# Altium schematic sheet ZLS-026.SchDoc
size Tabloid
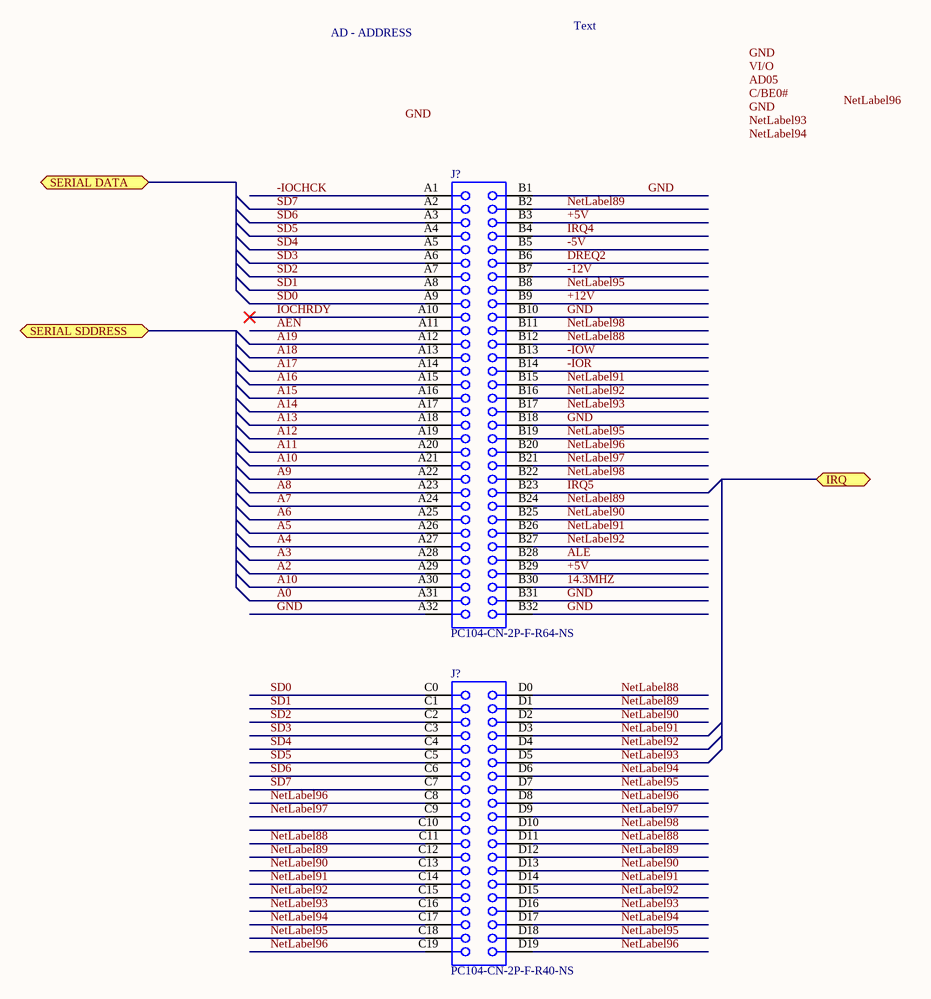
[diagram p0: ZLS-026.SchDoc]

## Parts
(Parts that share a designator on the sheet are numbered #1, #2 ... from top to bottom, then left to right.)
J?#1  PC104-CN-2P-F-R64-NS  [BTB2-54-V64F-03]
J?#2  PC104-CN-2P-F-R40-NS  [BTB2-54-V40F-03]

## Ports
IRQ, SERIAL DATA, SERIAL SDDRESS

## Nets
14.3MHZ: J?#1.B30
+5V: J?#1.B3 J?#1.B29
+12V: J?#1.B9
-5V: J?#1.B5
-12V: J?#1.B7
-IOCHCK: J?#1.A1
-IOR: J?#1.B14
-IOW: J?#1.B13
A0: J?#1.A31
A2: J?#1.A29
A3: J?#1.A28
A4: J?#1.A27
A5: J?#1.A26
A6: J?#1.A25
A7: J?#1.A24
A8: J?#1.A23
A9: J?#1.A22
A10: J?#1.A21 J?#1.A30
A11: J?#1.A20
A12: J?#1.A19
A13: J?#1.A18
A14: J?#1.A17
A15: J?#1.A16
A16: J?#1.A15
A17: J?#1.A14
A18: J?#1.A13
A19: J?#1.A12
AEN: J?#1.A11
ALE: J?#1.B28
DREQ2: J?#1.B6
GND: J?#1.A32 J?#1.B1 J?#1.B10 J?#1.B18 J?#1.B31 J?#1.B32
IOCHRDY: J?#1.A10
IRQ4: J?#1.B4
IRQ5: J?#1.B23
NetLabel88: J?#1.B12 J?#2.C11 J?#2.D0 J?#2.D11
NetLabel89: J?#1.B2 J?#1.B24 J?#2.C12 J?#2.D1 J?#2.D12
NetLabel90: J?#1.B25 J?#2.C13 J?#2.D2 J?#2.D13
NetLabel91: J?#1.B15 J?#1.B26 J?#2.C14 J?#2.D3 J?#2.D14
NetLabel92: J?#1.B16 J?#1.B27 J?#2.C15 J?#2.D4 J?#2.D15
NetLabel93: J?#1.B17 J?#2.C16 J?#2.D5 J?#2.D16
NetLabel94: J?#2.C17 J?#2.D6 J?#2.D17
NetLabel95: J?#1.B8 J?#1.B19 J?#2.C18 J?#2.D7 J?#2.D18
NetLabel96: J?#1.B20 J?#2.C8 J?#2.C19 J?#2.D8 J?#2.D19
NetLabel97: J?#1.B21 J?#2.C9 J?#2.D9
NetLabel98: J?#1.B11 J?#1.B22 J?#2.D10
SD0: J?#1.A9 J?#2.C0
SD1: J?#1.A8 J?#2.C1
SD2: J?#1.A7 J?#2.C2
SD3: J?#1.A6 J?#2.C3
SD4: J?#1.A5 J?#2.C4
SD5: J?#1.A4 J?#2.C5
SD6: J?#1.A3 J?#2.C6
SD7: J?#1.A2 J?#2.C7

Not connected (* = marked no-connect by the designer): J?#2 C10(31)

## Notes on the sheet
- AD - ADDRESS
- Text
- Labels drawn without touching a wire or pin: AD05, C/BE0#, GND, NetLabel93, NetLabel94, NetLabel96, VI/O
- Title
- Size:
- Date:
- Tabloid
- Number:
- Time:
- Revision:
- Sheet
- of
- ZLS Corporation
- 7801 North Lamar Blvd.
- Suite E-184
- Austin, Texas 78752  USA
- (512) 453-0288
- File:

## Library data of the parts
J?#1 = CMP-0001-00109-1: Board-to-Board Connector,  PC104 BA ISA, Vertical, 2-Row, 64-Postion, Pitch 2.54mm, Receptacle; Mating Connector: Harwin-M20-6113205 (Non-stackthrough); ClassName: Board Template Connector; Publisher: Altium; Package Reference: BTB2-54-V64F-03; Component Kind: Standard
J?#2 = CMP-0001-00108-1: Board-to-Board Connector,  PC104 CD ISA, Vertical, 2-Row, 40-Postion, Pitch 2.54mm, Receptacle; Mating Connector: Harwin-M20-6112005 (Non-stackthrough); Package Reference: BTB2-54-V40F-03; Component Kind: Standard; ClassName: Board Template Connector; Publisher: Altium